# Altium schematic sheet indicators.SchDoc
size A4; SheetNumber: 5; SheetTotal: 9
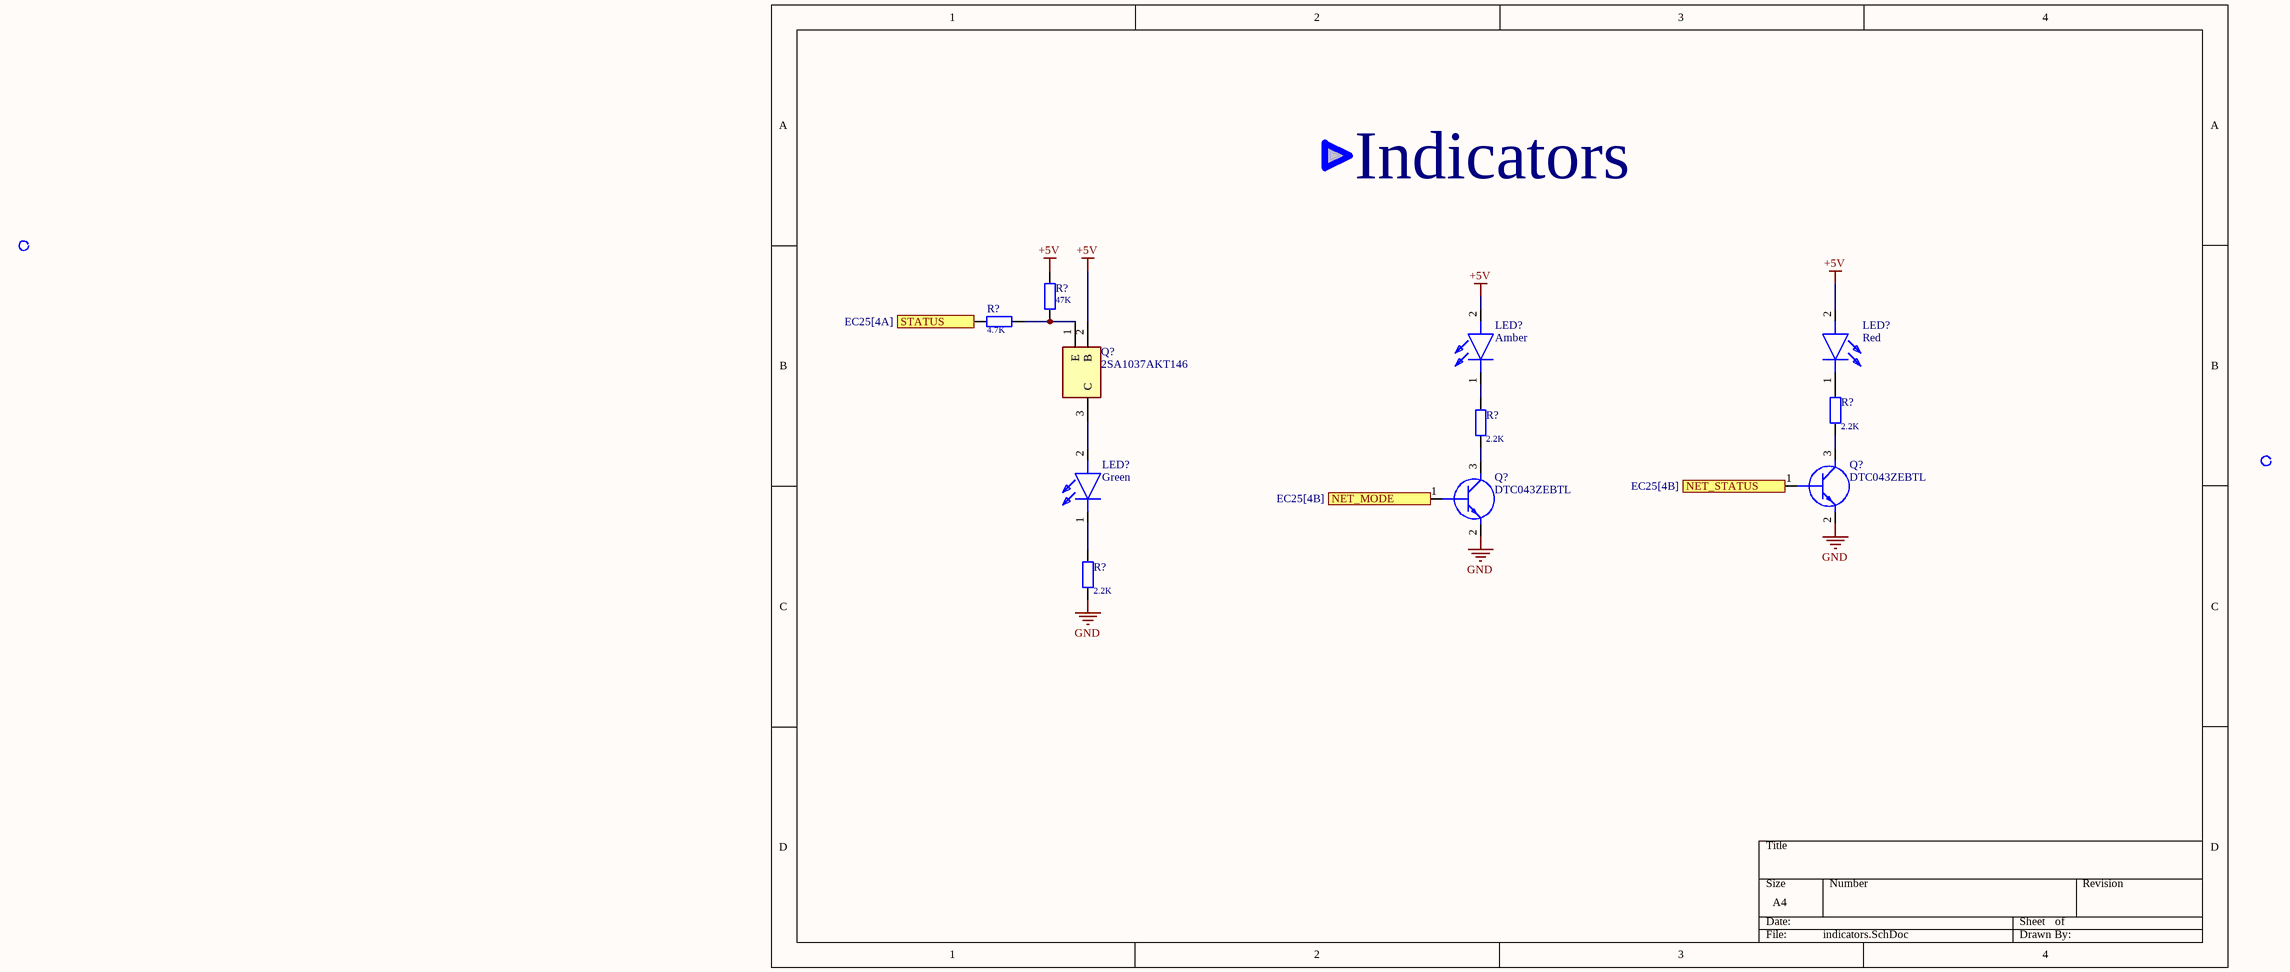
[diagram p0: indicators.SchDoc]

## Parts
(Parts that share a designator on the sheet are numbered #1, #2 ... from top to bottom, then left to right.)
LED?#1  Amber  [LEDC1608X80N]
LED?#2  Red  [LEDC1608X80N]
LED?#3  Green  [LEDC1608X80N]
Q?#1  2SA1037AKT146  [DTB123YKT146]
Q?#2  DTC043ZEBTL  [SOTFL50P160X85-3N]
Q?#3  DTC043ZEBTL  [SOTFL50P160X85-3N]
R?#1  value 47K  [RESC1005X04N]  (hidden comment: R)
R?#2  value 4.7K  [RESC1005X04N]  (hidden comment: R)
R?#3  value 2.2K  [RESC1005X04N]  (hidden comment: R)
R?#4  value 2.2K  [RESC1005X04N]  (hidden comment: R)
R?#5  value 2.2K  [RESC1005X04N]  (hidden comment: R)

## Ports
NET_MODE (in, see EC25[4B]), NET_STATUS (in, see EC25[4B]), STATUS (in, see EC25[4A])

## Nets
+5V: LED?#1.2(A) LED?#2.2(A) Q?#1.2(B) R?#1.1
GND: Q?#2.2(E) Q?#3.2(E) R?#5.1
NET_MODE: Q?#3.1(B) ; port NET_MODE
NET_STATUS: Q?#2.1(B) ; port NET_STATUS
STATUS: R?#2.1 ; port STATUS
NetLED?#1_1: LED?#1.1(K) R?#4.2
NetLED?#2_1: LED?#2.1(K) R?#3.2
NetLED?#3_1: LED?#3.1(K) R?#5.2
NetLED?#3_2: LED?#3.2(A) Q?#1.3(C)
NetQ?#1_1: Q?#1.1(E) R?#1.2 R?#2.2
NetQ?#2_3: Q?#2.3(C) R?#3.1
NetQ?#3_3: Q?#3.3(C) R?#4.1

## Notes on the sheet
- Indicators

## Library data of the parts
LED?#1 = 150060SS75000: LED; Manufacturer_Name: Wurth Elektronik; MPN: BL-HJC36G-AV-TRB; Height: 0.8mm; Mouser Part Number: 710-150060SS75000; Mouser Price/Stock: https://www.mouser.co.uk/ProductDetail/Wurth-Elektronik/150060SS75000?qs=LlUlMxKIyB0oQaxwspeTEA%3D%3D; Price: 0.; Link: https://www.lcsc.com/product-detail/LED-Indication-Discrete_BrtLed-Bright-LED-Elec-BL-HJC36G-AV-TRB_C165983.html?s_z=n_led%200603
LED?#2 = 150060SS75000: LED; Manufacturer_Name: Wurth Elektronik; MPN: XL-1608SURC-06; Height: 0.8mm; Mouser Part Number: 710-150060SS75000; Mouser Price/Stock: https://www.mouser.co.uk/ProductDetail/Wurth-Elektronik/150060SS75000?qs=LlUlMxKIyB0oQaxwspeTEA%3D%3D; Price: 0.003; Link: https://www.lcsc.com/product-detail/LED-Indication-Discrete_XINGLIGHT-XL-1608SURC-06_C965799.html
LED?#3 = 150060SS75000: LED; Manufacturer_Name: Wurth Elektronik; MPN: XL-1608UGC-04; Height: 0.8mm; Mouser Part Number: 710-150060SS75000; Mouser Price/Stock: https://www.mouser.co.uk/ProductDetail/Wurth-Elektronik/150060SS75000?qs=LlUlMxKIyB0oQaxwspeTEA%3D%3D; Price: 0.0041; Link: https://www.lcsc.com/product-detail/LED-Indication-Discrete_XINGLIGHT-XL-1608UGC-04_C965804.html
Q?#1 = 2SA1037AKT146: Transistor; Manufacturer_Name: ROHM Semiconductor; Height: 1mm; Manufacturer_Part_Number: 2SA1037AKT146; Mouser Part Number: N/A; Mouser Price/Stock: https://www.mouser.co.uk/ProductDetail/ROHM-Semiconductor/2SA1037AKT146?qs=zGux8KhMp6Koqnkrd3X73Q%3D%3D
Q?#2 Q?#3 = DTC043ZEBTL: Transistor BJT NPN; Manufacturer_Name: ROHM Semiconductor; Datasheet Link: http://rohmfs.rohm.com/en/products/databook/datasheet/discrete/transistor/digital/dtc043zmt2l-e.pdf; Height: 0.85mm; Manufacturer_Part_Number: DTC043ZEBTL; Mouser Part Number: 755-DTC043ZEBTL; Mouser Price/Stock: https://www.mouser.co.uk/ProductDetail/ROHM-Semiconductor/DTC043ZEBTL?qs=n7vHx8wJlDGyWrBOh0icRQ%3D%3D
R?#1-R?#5 = R: MPN: *; Link: *